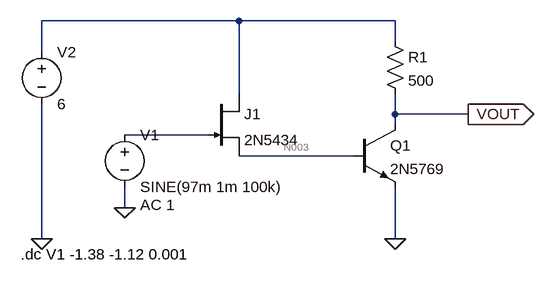
[diagram p0: schematic audio001.asc]
audio001.asc, the LTspice schematic file:
Version 4
SHEET 1 880 680
WIRE 96 -16 -208 -16
WIRE 336 -16 96 -16
WIRE 336 16 336 -16
WIRE -208 32 -208 -16
WIRE 96 96 96 -16
WIRE 336 128 336 96
WIRE 448 128 336 128
WIRE 336 144 336 128
WIRE 48 160 -80 160
WIRE 272 192 96 192
WIRE -80 272 -80 240
WIRE -208 320 -208 112
WIRE 336 320 336 240
FLAG 336 320 0
FLAG -80 272 0
FLAG -208 320 0
FLAG 448 128 VOUT
IOPIN 448 128 Out
SYMBOL npn 272 144 R0
SYMATTR InstName Q1
SYMATTR Value 2N5769
SYMBOL res 320 0 R0
SYMATTR InstName R1
SYMATTR Value 500
SYMBOL voltage -80 144 R0
WINDOW 123 24 124 Left 2
WINDOW 39 0 0 Left 0
SYMATTR Value2 AC 1
SYMATTR InstName V1
SYMATTR Value SINE(97m 1m 100k)
SYMBOL voltage -208 16 R0
WINDOW 123 0 0 Left 0
WINDOW 39 0 0 Left 0
SYMATTR InstName V2
SYMATTR Value 6
SYMBOL njf 48 96 R0
SYMATTR InstName J1
SYMATTR Value 2N5434
TEXT -240 344 Left 2 !.dc V1 -1.38 -1.12 0.001

The netlist it stands for:
* audio001.asc
Q1 VOUT N003 0 0 2N5769
R1 N001 VOUT 500
V1 N002 0 SINE(97m 1m 100k) AC 1
V2 N001 0 6
J1 N001 N002 N003 2N5434
.model NPN NPN
.model PNP PNP
.lib standard.bjt
.model NJF NJF
.model PJF PJF
.lib standard.jft
.dc V1 -1.38 -1.12 0.001
.backanno
.end

* Results of the author's LTspice run, read from the files saved beside the schematic
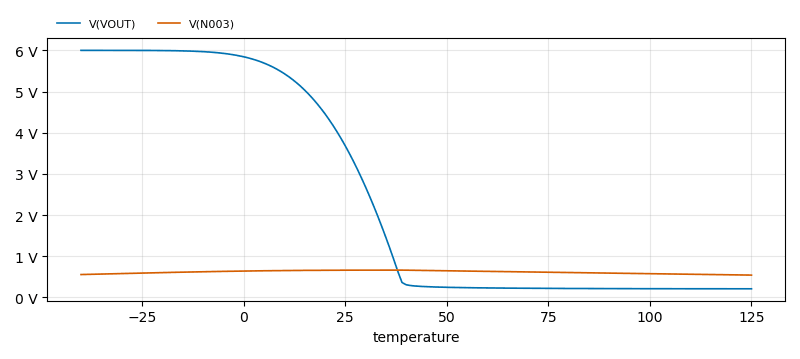
[diagram p1: DC transfer characteristic of audio001.asc, plotted from the saved traces]
* DC transfer characteristic, 1 run:
*   V(VOUT): 6 V at temperature=-40 , 207.7 mV at temperature=125 , min 207.7 mV, max 6 V
*   V(N003): 554 mV at temperature=-40 , 540.5 mV at temperature=125 , min 540.5 mV, max 661.8 mV